# Altium schematic sheet Low Speed Expansion.SchDoc: Low Speed Expansion
size Tabloid; ApprovedBy: NA; CompanyName: Cospan Design LLC; DrawnBy: David McCoy; Engineer: David McCoy; DocumentNumber: 9; Revision: A; SheetNumber: 9; SheetTotal: 18; Client: OSH; Project: Guppy Buddy; ProjectPrettyName: Guppy Buddy
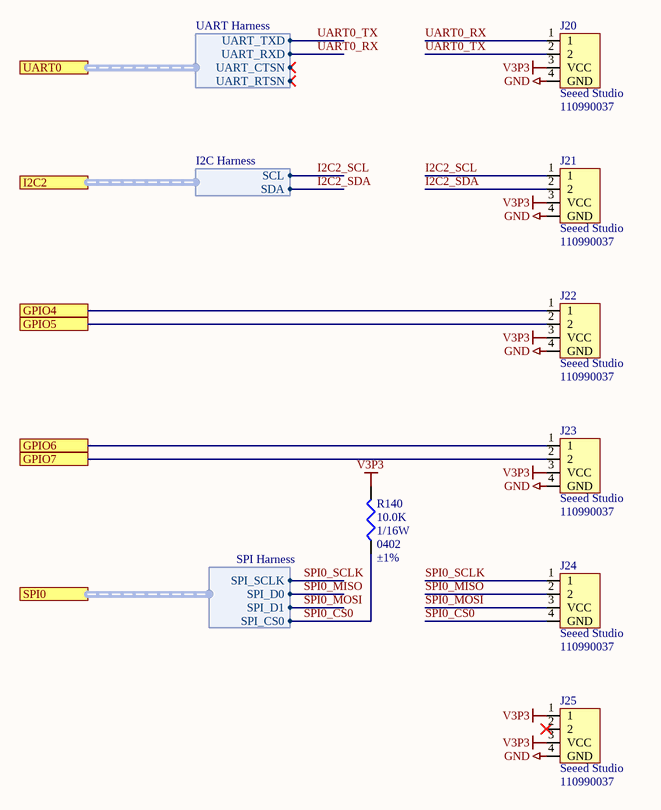
[diagram p0: Low Speed Expansion.SchDoc]

## Parts
J20  Manufacturer 1: Seeed Studio  Manufacturer Part Number 1: 110990037  [HW4-2.0-90D]  (hidden comment: 320110034)
J21  Manufacturer 1: Seeed Studio  Manufacturer Part Number 1: 110990037  [HW4-2.0-90D]  (hidden comment: 320110034)
J22  Manufacturer 1: Seeed Studio  Manufacturer Part Number 1: 110990037  [HW4-2.0-90D]  (hidden comment: 320110034)
J23  Manufacturer 1: Seeed Studio  Manufacturer Part Number 1: 110990037  [HW4-2.0-90D]  (hidden comment: 320110034)
J24  Manufacturer 1: Seeed Studio  Manufacturer Part Number 1: 110990037  [HW4-2.0-90D]  (hidden comment: 320110034)
J25  Manufacturer 1: Seeed Studio  Manufacturer Part Number 1: 110990037  [HW4-2.0-90D]  (hidden comment: 320110034)
R140  Resistance In Ohms: 10.0K  Power (Watts): 1/16W  Case: 0402  Tolerance: ±1%  [R_0402]  (hidden comment: R_0402_10.0K)

## Ports
GPIO4, GPIO5, GPIO6, GPIO7, I2C2 (harness I2C Harness), SPI0 (harness SPI Harness), UART0 (harness UART Harness)

## Harnesses
UART Harness: UART_TXD, UART_RXD, UART_CTSN, UART_RTSN
I2C Harness: SCL, SDA
SPI Harness: SPI_SCLK, SPI_D0, SPI_D1, SPI_CS0

## Nets
GND: J20.4(GND) J21.4(GND) J22.4(GND) J23.4(GND) J25.4(GND)
V3P3: J20.3(VCC) J21.3(VCC) J22.3(VCC) J23.3(VCC) J25.1 J25.3(VCC) R140.1
GPIO4: J22.1 ; port GPIO4
GPIO5: J22.2 ; port GPIO5
GPIO6: J23.1 ; port GPIO6
GPIO7: J23.2 ; port GPIO7
I2C2_SCL: J21.1 ; port I2C2.SCL
I2C2_SDA: J21.2 ; port I2C2.SDA
SPI0_CS0: J24.4(GND) R140.2 ; port SPI0.SPI_CS0
SPI0_MISO: J24.2 ; port SPI0.SPI_D0
SPI0_MOSI: J24.3(VCC) ; port SPI0.SPI_D1
SPI0_SCLK: J24.1 ; port SPI0.SPI_SCLK
UART0_RX: J20.1 ; port UART0.UART_RXD
UART0_TX: J20.2 ; port UART0.UART_TXD

Not connected (* = marked no-connect by the designer): J25 2*

## Notes on the sheet
- Project:
- http://www.cospandesign.com
- Cospan Design
- Document:
- Engineer:
- Title:
- Client:
- Approved By:
- Revision:
- Date:
- Number:
- of

## Library data of the parts
J20-J25 = J_GROVE-CONNECTOR-DIP-90D(4P-2.0): SymbolName_1: GROVE-CONNECTOR-DIP; LibraryName: Seeed-Connector -2016; Package: HW4-2.0-90D; Supplier 1: Digi-Key; Supplier Part Number 1: 1597-1083-ND; Stock 1: 714; Pricing 1: 1=1.53 (USD); ComponentLink1URL: http://www.seeedstudio.com/document/pdf/Preface.pdf; ComponentLink1Description: http://www.seeedstudio.com/document/pdf/Preface.pdf; ComponentLink2URL: http://www.mouser.com/ds/2/744/Seeed_316010005-786598.pdf; ComponentLink2Description: http://www.mouser.com/ds/2/744/Seeed_316010005-786598.pdf
R140 = R_0402_10.0K: RES 10.0K OHM 1/16W 1% 0402 SMD; Manufacturer: Stackpole Electronics Inc; Manufacturer Part Number: RMCF0402FT10K0; Resistance (Ohms): 10k; Temperature Coefficient: ±100ppm/°C; Supplier 1: Digi-Key; Supplier Part Number 1: RMCF0402FT10K0CT-ND; RoHS: RoHS Compliant; Category: Resistors; Stock 1: 234525; Pricing: 1=0.04, 10=0.025, 50=0.0138, 100=0.0105, 250=0.0078, 500=0.00576, 1000=0.00384, 2500=0.00324, 5000=0.0027 (USD); Composition: Thick Film; Features: -; Package / Case: 0402 (1005 Metric); Size / Dimension: 0.039" L x 0.020" W (1.00mm x 0.50mm); Height: 0.016" (0.40mm); Number of Terminations: 2; Packaging: Cut Tape (CT); ComponentLink1URL: http://www.seielect.com/Catalog/SEI-RMCF_RMCP.pdf; ComponentLink1Description: http://www.seielect.com/Catalog/SEI-RMCF_RMCP.pdf